# Altium schematic sheet Equivalent Resistance RFBT 3V3.SchDoc
size A; SheetNumber: 3; SheetTotal: 3
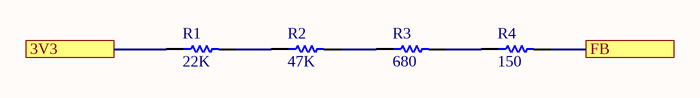
[diagram p0: Equivalent Resistance RFBT 3V3.SchDoc]

## Parts
R1  value 22K  (hidden comment: Resistor)
R2  value 47K  (hidden comment: Resistor)
R3  value 680  (hidden comment: Resistor)
R4  value 150  (hidden comment: Resistor)

## Ports
3V3 (see Equivalent Inductance 3V3[3B]), FB

## Nets
3V3: R1.1 ; port 3V3
FB: R4.2 ; port FB
NetR1_2: R1.2 R2.1
NetR2_2: R2.2 R3.1
NetR3_2: R3.2 R4.1

## Library data of the parts
R1-R4 = Resistor: TC1: 0; SimulationGenericComponent: True; TC2: 0